# Altium schematic sheet metal-detector.SchDoc
size A4; SheetNumber: 3; SheetTotal: 5
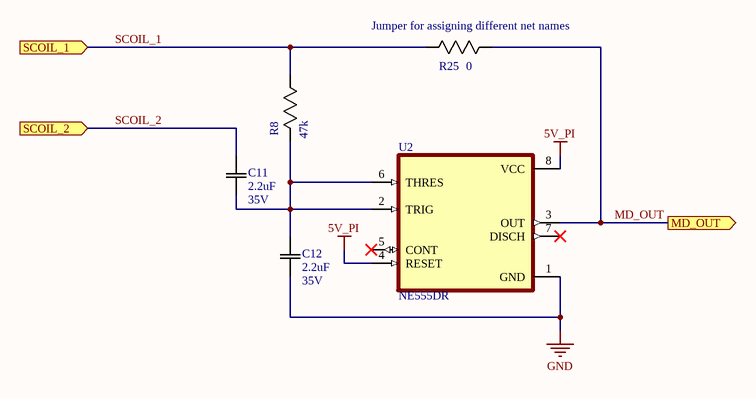
[diagram p0: metal-detector.SchDoc]

## Parts
C11  Rating: 35V  [0805]  (hidden comment: 2.2uF)
C12  Rating: 35V  [0805]  (hidden comment: 2.2uF)
R8  47k  [0805]
R25  0  [0805]
U2  NE555DR  [SOIC127P599X175-8N]

## Ports
MD_OUT (out), SCOIL_1 (in), SCOIL_2 (in)

## Nets
5V_PI: U2.4(RESET) U2.8(VCC)
GND: C12.1(C1) U2.1(GND)
MD_OUT: R25.1(R1) U2.3(OUT) ; port MD_OUT
SCOIL_1: R8.1(R1) R25.2(R2) ; port SCOIL_1
SCOIL_2: C11.2(C2) ; port SCOIL_2
NetC11_1: C11.1(C1) C12.2(C2) R8.2(R2) U2.2(TRIG) U2.6(THRES)

Not connected (* = marked no-connect by the designer): U2 5(CONT)* 7(DISCH)*

## Notes on the sheet
- (near R25) Jumper for assigning different net names

## Library data of the parts
C11 C12 = CAP 2.2uF 35V: CAP CER 2.2UF 35V X7R 0603/0805; Manufacturer Part Number 1: C1608X5R1V225K080AC; Tolerance: 10%; Temperature Coefficient: X5R; Package: 0603/0805; Operating Temperature: -55°C ~ 125°C; Value: 2.2uF; Part Number: CAP 2.2uF 35V; Supplier 1: Digi-Key; Supplier Part Number 1: 445-8025-1-ND; Manufacturer Part Number 2: CGA4J1X7R1V225K125AE; Supplier 2: Digi-Key; Supplier Part Number 2: 445-8787-1-ND
R8 = RES 47k 1/8W - 1%: RES SMD 47K OHM 1% 1/8W 0603; Manufacturer Part Number 1: MCT06030C4702FP500; Power (Watts): 0.125W; Package: 0805; Value: 47k; Tolerance: 1%; Part Number: RES 47k 1/8W - 1%; Supplier 1: Digi-Key; Supplier Part Number 1: MCT0603-47.0K-CFCT-ND; Supplier URL 1: https://www.digikey.ca/en/products/detail/vishay-beyschlag-draloric-bc-components/MCT06030C4702FP500/2607854?s=N4IgTCBcDaILIGEAqAGAbCgzAWgCwHYA6FAaWwQDFlsA5AERAF0BfIA
R25 = RES 0 JUMPER 0603: Default Resistor Symbol; Power (Watts): 0.125W; Package: 0805; Tolerance: N/A; Value: 0; Part Number: RES 0 JUMPER 0603
U2 = NE555DR: MF: {'manufacturer': u'Texas Instruments'}; Package: None; Price: None; Value: *; MP: NE555DR; Availability: Unavailable